# Altium project Elkapod_power_supply_controller_module.PrjPcb (part 3 of 5)

## Sheet Servos_controller.SchDoc
size A4; SheetNumber: 2; SheetTotal: 6
Used 3 times, as channels U_Servos_controller, U_Servos_controller, U_Servos_controller. Parts and nets are listed once, with the designators drawn on the sheet.
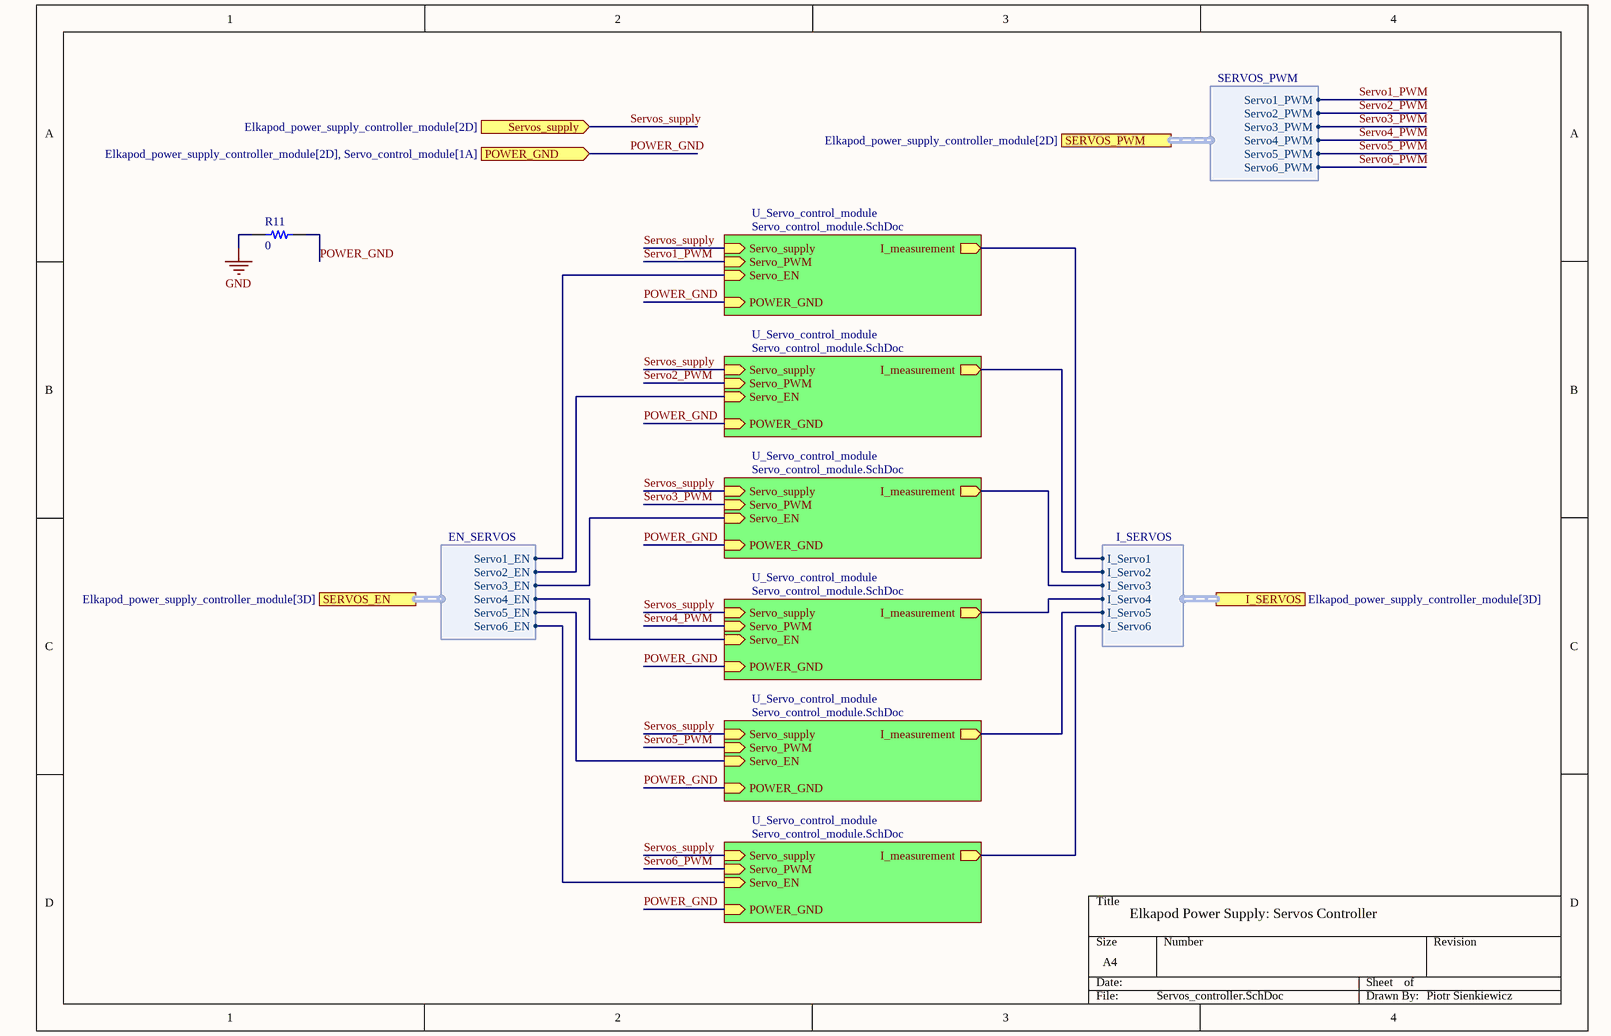
[diagram p6: Servos_controller.SchDoc]

### Parts
R11  0  [RES 0603_1608]

### Sub-sheets
U_Servo_control_module = Servo_control_module.SchDoc: Servo_supply (in), Servo_PWM (in), I_measurement (out), Servo_EN (in), POWER_GND (in)
U_Servo_control_module = Servo_control_module.SchDoc: Servo_supply (in), Servo_PWM (in), I_measurement (out), Servo_EN (in), POWER_GND (in)
U_Servo_control_module = Servo_control_module.SchDoc: Servo_supply (in), Servo_PWM (in), I_measurement (out), Servo_EN (in), POWER_GND (in)
U_Servo_control_module = Servo_control_module.SchDoc: Servo_supply (in), Servo_PWM (in), I_measurement (out), Servo_EN (in), POWER_GND (in)
U_Servo_control_module = Servo_control_module.SchDoc: Servo_supply (in), Servo_PWM (in), I_measurement (out), Servo_EN (in), POWER_GND (in)
U_Servo_control_module = Servo_control_module.SchDoc: Servo_supply (in), Servo_PWM (in), I_measurement (out), Servo_EN (in), POWER_GND (in)

### Ports
I_SERVOS (harness I_SERVOS, see Elkapod_power_supply_controller_module[3D]), POWER_GND (in, see Elkapod_power_supply_controller_module[2D], Servo_control_module[1A]), SERVOS_EN (harness EN_SERVOS, see Elkapod_power_supply_controller_module[3D]), SERVOS_PWM (harness SERVOS_PWM, see Elkapod_power_supply_controller_module[2D]), Servos_supply (in, see Elkapod_power_supply_controller_module[2D])

### Harnesses
I_SERVOS: I_Servo1, I_Servo2, I_Servo3, I_Servo4, I_Servo5, I_Servo6
EN_SERVOS: Servo1_EN, Servo2_EN, Servo3_EN, Servo4_EN, Servo5_EN, Servo6_EN
SERVOS_PWM: Servo1_PWM, Servo2_PWM, Servo3_PWM, Servo4_PWM, Servo5_PWM, Servo6_PWM

### Nets
GND: R11.1
POWER_GND: R11.2 ; port POWER_GND, sheet U_Servo_control_module/POWER_GND, sheet U_Servo_control_module/POWER_GND, sheet U_Servo_control_module/POWER_GND, sheet U_Servo_control_module/POWER_GND, sheet U_Servo_control_module/POWER_GND, sheet U_Servo_control_module/POWER_GND
Servo1_PWM: sheet U_Servo_control_module/Servo_PWM, port SERVOS_PWM.Servo1_PWM
Servo2_PWM: sheet U_Servo_control_module/Servo_PWM, port SERVOS_PWM.Servo2_PWM
Servo3_PWM: sheet U_Servo_control_module/Servo_PWM, port SERVOS_PWM.Servo3_PWM
Servo4_PWM: sheet U_Servo_control_module/Servo_PWM, port SERVOS_PWM.Servo4_PWM
Servo5_PWM: sheet U_Servo_control_module/Servo_PWM, port SERVOS_PWM.Servo5_PWM
Servo6_PWM: sheet U_Servo_control_module/Servo_PWM, port SERVOS_PWM.Servo6_PWM
Servos_supply: port Servos_supply, sheet U_Servo_control_module/Servo_supply, sheet U_Servo_control_module/Servo_supply, sheet U_Servo_control_module/Servo_supply, sheet U_Servo_control_module/Servo_supply, sheet U_Servo_control_module/Servo_supply, sheet U_Servo_control_module/Servo_supply
(unnamed): sheet U_Servo_control_module/I_measurement, port I_SERVOS.I_Servo1
(unnamed): sheet U_Servo_control_module/Servo_EN, port SERVOS_EN.Servo1_EN
(unnamed): sheet U_Servo_control_module/I_measurement, port I_SERVOS.I_Servo2
(unnamed): sheet U_Servo_control_module/Servo_EN, port SERVOS_EN.Servo2_EN
(unnamed): sheet U_Servo_control_module/I_measurement, port I_SERVOS.I_Servo3
(unnamed): sheet U_Servo_control_module/Servo_EN, port SERVOS_EN.Servo3_EN
(unnamed): sheet U_Servo_control_module/I_measurement, port I_SERVOS.I_Servo4
(unnamed): sheet U_Servo_control_module/Servo_EN, port SERVOS_EN.Servo4_EN
(unnamed): sheet U_Servo_control_module/I_measurement, port I_SERVOS.I_Servo5
(unnamed): sheet U_Servo_control_module/Servo_EN, port SERVOS_EN.Servo5_EN
(unnamed): sheet U_Servo_control_module/I_measurement, port I_SERVOS.I_Servo6
(unnamed): sheet U_Servo_control_module/Servo_EN, port SERVOS_EN.Servo6_EN

### Channels
U_Servos_controller: designators end in _U_Servos_controller#1; ports POWER_GND=POWER_GND Servos_supply=Servo_supply
U_Servos_controller: designators end in _U_Servos_controller#2; ports POWER_GND=POWER_GND Servos_supply=Servo_supply
U_Servos_controller: designators end in _U_Servos_controller#3; ports POWER_GND=POWER_GND Servos_supply=Servo_supply

### Notes on the sheet
- Elkapod Power Supply: Servos Controller
- Piotr Sienkiewicz

### Library data of the parts
R11 = RNCS0603BKE10K0: RES 0 OHM 1% 0,1W 0603; Manufacturer: Stackpole Electronics Inc; Power (Watts): 0.063W, 1/16W; Temperature Coefficient: ±25ppm/°C; Tolerance: ±0.1%; Part Number: RNCS0603BKE10K0; Value: 0; Composition: Thin Film; Device Package: 0603 (1608 Metric); Features: Anti-Corrosive, Automotive AEC-Q200, Moisture Resistant; Height - Seated (Max): 0.022" (0.55mm); LastUpdated: 09.02.2024 20:43:37; Lifecycle Status: Active; Minimum Order: 1; Number of Terminations: 2; Operating Temperature: -55°C ~ 155°C; Package / Case: 0603 (1608 Metric); Packaging: TapeAndReel; PartId: 4838; Part Status: Active; Price: 0.06; Ratings: AEC-Q200; Resistance: 0; Series: RNCS; Size / Dimension: 0.061" L x 0.031" W (1.55mm x 0.80mm); Supplier Device Package: 0603

## Sheet Servo_control_module.SchDoc
size A4; SheetNumber: 3; SheetTotal: 6
Used 18 times, as channels U_Servos_controller/U_Servo_control_module, U_Servos_controller/U_Servo_control_module, U_Servos_controller/U_Servo_control_module, U_Servos_controller/U_Servo_control_module, U_Servos_controller/U_Servo_control_module, U_Servos_controller/U_Servo_control_module, U_Servos_controller/U_Servo_control_module, U_Servos_controller/U_Servo_control_module, U_Servos_controller/U_Servo_control_module, U_Servos_controller/U_Servo_control_module, U_Servos_controller/U_Servo_control_module, U_Servos_controller/U_Servo_control_module, U_Servos_controller/U_Servo_control_module, U_Servos_controller/U_Servo_control_module, U_Servos_controller/U_Servo_control_module, U_Servos_controller/U_Servo_control_module, U_Servos_controller/U_Servo_control_module, U_Servos_controller/U_Servo_control_module. Parts and nets are listed once, with the designators drawn on the sheet.
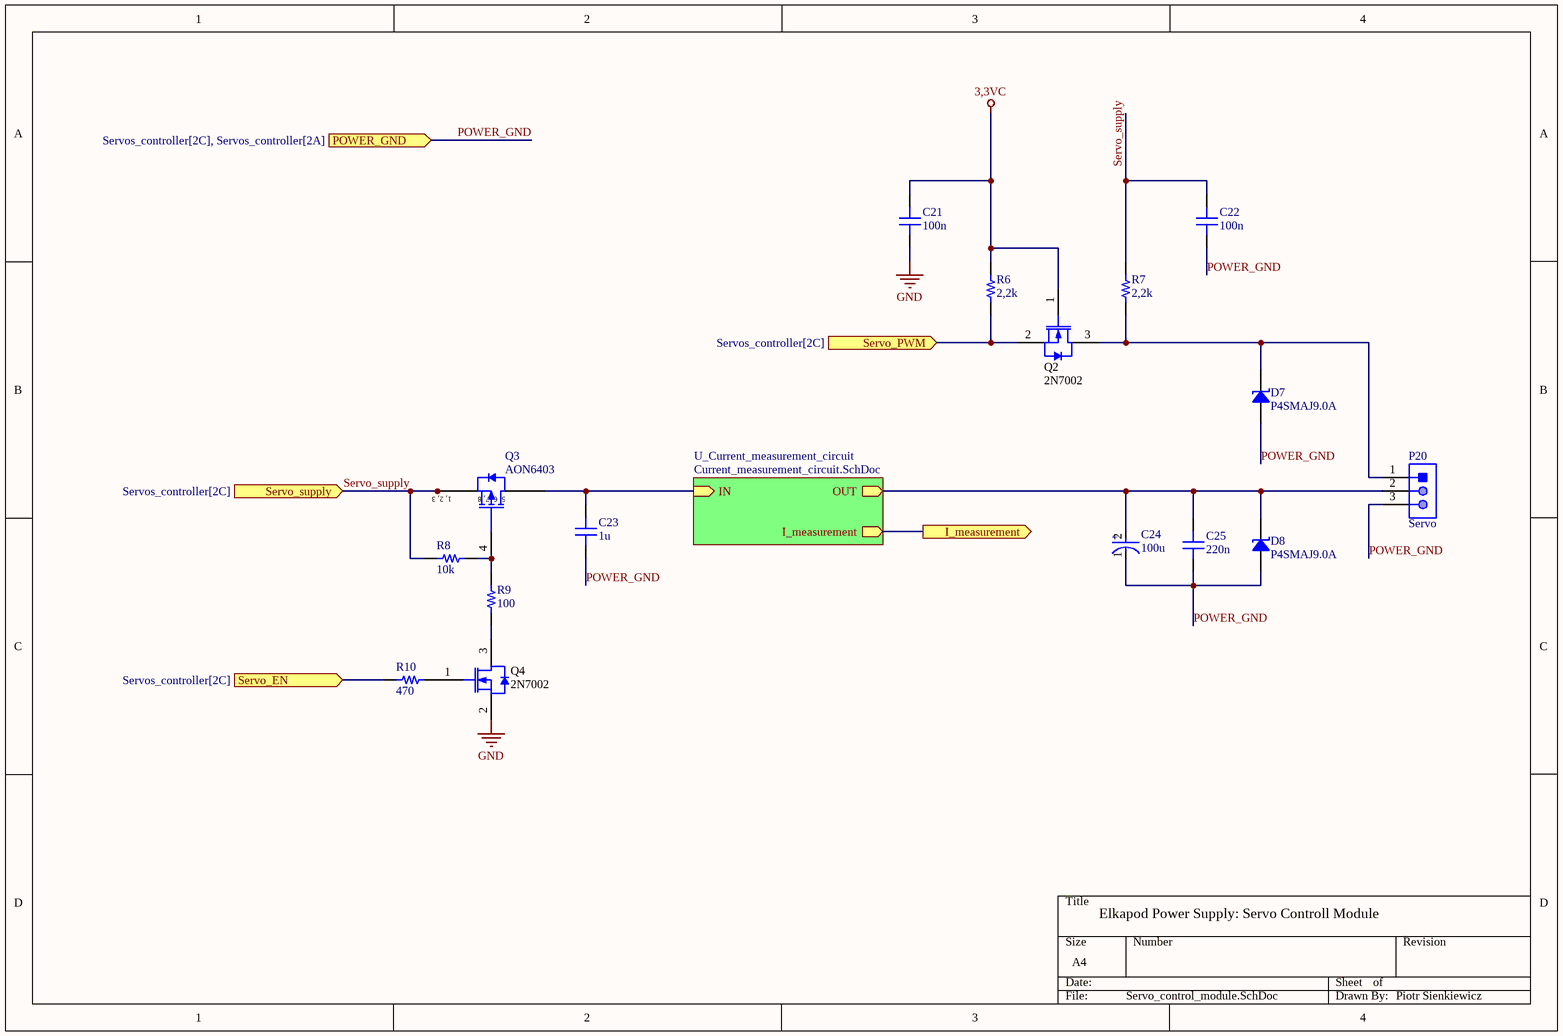
[diagram p7: Servo_control_module.SchDoc]

### Parts
C21  100n  [CAP 0603_1608]
C22  100n  [CAP 0603_1608]
C23  1u  [CAP 0603_1608]
C24  100u  [FP-FKE-MFG]
C25  220n  [CAP 0603_1608]
D7  P4SMAJ9.0A  [DO214AC SMA]
D8  P4SMAJ9.0A  [DO214AC SMA]
P20  Servo  [MOLX-22-23-2031_V]
Q2  2N7002  [INF-PG-SOT23_M]
Q3  AON6403  [DFN5x6]
Q4  2N7002  [INF-PG-SOT23_M]
R6  2,2k  [RES 0603_1608]
R7  2,2k  [RES 0603_1608]
R8  10k  [RES 0603_1608]
R9  100  [RES 0603_1608]
R10  470  [RES 0603_1608]

### Sub-sheets
U_Current_measurement_circuit = Current_measurement_circuit.SchDoc: I_measurement (out), IN (in), OUT (out)  | Rsense_value: 8m; C_value: 10u

### Ports
I_measurement (out, see Servos_controller[3C], Current_measurement_circuit[3B]), POWER_GND (in, see Servos_controller[2C], Servos_controller[2A]), Servo_EN (in, see Servos_controller[2C]), Servo_PWM (in, see Servos_controller[2C]), Servo_supply (in, see Servos_controller[2C])

### Nets
3,3VC: C21.2 Q2.1(GATE) R6.2
GND: C21.1 Q4.2(SOURCE)
I_measurement: port I_measurement, sheet U_Current_measurement_circuit/I_measurement
POWER_GND: C22.1 C23.1 C24.1(C) C25.2 D7.1 D8.1 P20.3 ; port POWER_GND
Servo_EN: R10.1 ; port Servo_EN
Servo_PWM: Q2.2(SOURCE) R6.1 ; port Servo_PWM
Servo_supply: C22.2 Q3.1(S) Q3.2(S) Q3.3(S) R7.2 R8.1 ; port Servo_supply
NetC23_2: C23.2 Q3.5(D) ; sheet U_Current_measurement_circuit/IN
NetC24_2: C24.2(A) C25.1 D8.2 P20.2 ; sheet U_Current_measurement_circuit/OUT
NetD7_2: D7.2 P20.1 Q2.3(DRAIN) R7.1
NetQ3_4: Q3.4(G) R8.2 R9.2
NetQ4_1: Q4.1(GATE) R10.2
NetQ4_3: Q4.3(DRAIN) R9.1

### Channels
U_Servos_controller/U_Servo_control_module: designators end in _U_Servos_controller_U_Servo_control_module#1; ports I_measurement=I_SERVO13 POWER_GND=POWER_GND Servo_EN=SERVO13_EN Servo_PWM=PWM13 Servo_supply=Servo_supply
U_Servos_controller/U_Servo_control_module: designators end in _U_Servos_controller_U_Servo_control_module#2; ports I_measurement=I_SERVO14 POWER_GND=POWER_GND Servo_EN=SERVO14_EN Servo_PWM=PWM14 Servo_supply=Servo_supply
U_Servos_controller/U_Servo_control_module: designators end in _U_Servos_controller_U_Servo_control_module#3; ports I_measurement=I_SERVO15 POWER_GND=POWER_GND Servo_EN=SERVO15_EN Servo_PWM=PWM15 Servo_supply=Servo_supply
U_Servos_controller/U_Servo_control_module: designators end in _U_Servos_controller_U_Servo_control_module#4; ports I_measurement=I_SERVO16 POWER_GND=POWER_GND Servo_EN=SERVO16_EN Servo_PWM=PWM16 Servo_supply=Servo_supply
U_Servos_controller/U_Servo_control_module: designators end in _U_Servos_controller_U_Servo_control_module#5; ports I_measurement=I_SERVO17 POWER_GND=POWER_GND Servo_EN=SERVO17_EN Servo_PWM=PWM17 Servo_supply=Servo_supply
U_Servos_controller/U_Servo_control_module: designators end in _U_Servos_controller_U_Servo_control_module#6; ports I_measurement=I_SERVO18 POWER_GND=POWER_GND Servo_EN=SERVO18_EN Servo_PWM=PWM18 Servo_supply=Servo_supply
U_Servos_controller/U_Servo_control_module: designators end in _U_Servos_controller_U_Servo_control_module#7; ports I_measurement=I_SERVO1 POWER_GND=POWER_GND Servo_EN=SERVO1_EN Servo_PWM=PWM1 Servo_supply=Servo_supply
U_Servos_controller/U_Servo_control_module: designators end in _U_Servos_controller_U_Servo_control_module#8; ports I_measurement=I_SERVO2 POWER_GND=POWER_GND Servo_EN=SERVO2_EN Servo_PWM=PWM2 Servo_supply=Servo_supply
U_Servos_controller/U_Servo_control_module: designators end in _U_Servos_controller_U_Servo_control_module#9; ports I_measurement=I_SERVO3 POWER_GND=POWER_GND Servo_EN=SERVO3_EN Servo_PWM=PWM3 Servo_supply=Servo_supply
U_Servos_controller/U_Servo_control_module: designators end in _U_Servos_controller_U_Servo_control_module#10; ports I_measurement=I_SERVO4 POWER_GND=POWER_GND Servo_EN=SERVO4_EN Servo_PWM=PWM4 Servo_supply=Servo_supply
U_Servos_controller/U_Servo_control_module: designators end in _U_Servos_controller_U_Servo_control_module#11; ports I_measurement=I_SERVO5 POWER_GND=POWER_GND Servo_EN=SERVO5_EN Servo_PWM=PWM5 Servo_supply=Servo_supply
U_Servos_controller/U_Servo_control_module: designators end in _U_Servos_controller_U_Servo_control_module#12; ports I_measurement=I_SERVO6 POWER_GND=POWER_GND Servo_EN=SERVO6_EN Servo_PWM=PWM6 Servo_supply=Servo_supply
U_Servos_controller/U_Servo_control_module: designators end in _U_Servos_controller_U_Servo_control_module#13; ports I_measurement=I_SERVO7 POWER_GND=POWER_GND Servo_EN=SERVO7_EN Servo_PWM=PWM7 Servo_supply=Servo_supply
U_Servos_controller/U_Servo_control_module: designators end in _U_Servos_controller_U_Servo_control_module#14; ports I_measurement=I_SERVO8 POWER_GND=POWER_GND Servo_EN=SERVO8_EN Servo_PWM=PWM8 Servo_supply=Servo_supply
U_Servos_controller/U_Servo_control_module: designators end in _U_Servos_controller_U_Servo_control_module#15; ports I_measurement=I_SERVO9 POWER_GND=POWER_GND Servo_EN=SERVO9_EN Servo_PWM=PWM9 Servo_supply=Servo_supply
U_Servos_controller/U_Servo_control_module: designators end in _U_Servos_controller_U_Servo_control_module#16; ports I_measurement=I_SERVO10 POWER_GND=POWER_GND Servo_EN=SERVO10_EN Servo_PWM=PWM10 Servo_supply=Servo_supply
U_Servos_controller/U_Servo_control_module: designators end in _U_Servos_controller_U_Servo_control_module#17; ports I_measurement=I_SERVO11 POWER_GND=POWER_GND Servo_EN=SERVO11_EN Servo_PWM=PWM11 Servo_supply=Servo_supply
U_Servos_controller/U_Servo_control_module: designators end in _U_Servos_controller_U_Servo_control_module#18; ports I_measurement=I_SERVO12 POWER_GND=POWER_GND Servo_EN=SERVO12_EN Servo_PWM=PWM12 Servo_supply=Servo_supply

### Notes on the sheet
- Elkapod Power Supply: Servo Controll Module
- Piotr Sienkiewicz
- (in symbol AON6403) 1, 2, 3; 5, 6, 7, 8
- (in symbol CMP-2000-06205-2) +

### Library data of the parts
C21 C22 = C0603C272F3GAC7867: CAP CER 100nF 25V X5R 0603; manufacturer: KEMET; Temperature Coefficient: C0G, NP0; Tolerance: ±1%; Part Number: C0603C272F3GAC7867; Value: 100n; Applications: General Purpose; Capacitance: 100n; componentlink1description: Datasheet; componentlink1url: https://api.kemet.com/component-edge/download/datasheet/C0603C272F3GACTU.pdf; componentlink2description: DigiKey Link; componentlink2url: https://www.digikey.com/en/products/detail/kemet/C0603C272F3GAC7867/2200413; Device Package: 0603 (1608 Metric); Features: Low ESL; lastupdated: 09.02.2024 20:10:30; Lifecycle Status: Active; Minimum Order: 1; Mounting Type: Surface Mount, MLCC; Operating Temperature: -55°C ~ 125°C; Package / Case: 0603 (1608 Metric); packaging: TapeAndReel; partid: 2138; Part Status: Active; price: 0.40; series: SMD Comm C0G; Size / Dimension: 0.063" L x 0.031" W (1.60mm x 0.80mm); Thickness (Max): 0.034" (0.87mm); Voltage - Rated: 25V
C23 = C0603C272F3GAC7867: CAP CER 1uF 16V X5R 0603; manufacturer: KEMET; Temperature Coefficient: C0G, NP0; Tolerance: ±1%; Voltage - Rated: 25V; Part Number: C0603C272F3GAC7867; Value: 1u; Applications: General Purpose; Capacitance: 1u; componentlink1description: Datasheet; componentlink1url: https://api.kemet.com/component-edge/download/datasheet/C0603C272F3GACTU.pdf; componentlink2description: DigiKey Link; componentlink2url: https://www.digikey.com/en/products/detail/kemet/C0603C272F3GAC7867/2200413; Device Package: 0603 (1608 Metric); Features: Low ESL; lastupdated: 09.02.2024 20:10:30; Lifecycle Status: Active; Minimum Order: 1; Mounting Type: Surface Mount, MLCC; Operating Temperature: -55°C ~ 125°C; Package / Case: 0603 (1608 Metric); packaging: TapeAndReel; partid: 2138; Part Status: Active; price: 0.40; series: SMD Comm C0G; Size / Dimension: 0.063" L x 0.031" W (1.60mm x 0.80mm); Thickness (Max): 0.034" (0.87mm)
C24 = CMP-2000-06205-2: CAP ALUM 100UF 20% 25V SMD; Ripple Current (AC): 300mA; Leakage Current: 3uA; Dielectric Material: Aluminium; Impedance: 260mR; Life (Hours): 2000Hour; Max Operating Temperature: 105°C; Voltage Rating (DC): 25V; Packaging: Tape and Reel; Min Operating Temperature: -55°C; Capacitance: 100uF; Ripple Current: 300mA; Mount: Surface Mount; Lead Free: Lead Free; Construction: Cylindrical; Voltage Rating: 25V; RoHS Compliant: Yes; Case/Package: Radial; Height: 6.2mm; Tolerance: 20%; Diameter: 8mm; Termination: SMD/SMT; Package Quantity: 1; Width: 8.3mm; REACH SVHC: No SVHC; Series: FK; Number of Pins: 2; Voltage: 25V; Radiation Hardening: No; Height - Seated (Max): 0.244inch; Length: 6.2mm; ESR (Equivalent Series Resistance): 260mR
C25 = C0603C272F3GAC7867: CAP CER 220nF 25V X5R 0603; manufacturer: KEMET; Temperature Coefficient: C0G, NP0; Tolerance: ±1%; Part Number: C0603C272F3GAC7867; Value: 220n; Applications: General Purpose; Capacitance: 220n; componentlink1description: Datasheet; componentlink1url: https://api.kemet.com/component-edge/download/datasheet/C0603C272F3GACTU.pdf; componentlink2description: DigiKey Link; componentlink2url: https://www.digikey.com/en/products/detail/kemet/C0603C272F3GAC7867/2200413; Device Package: 0603 (1608 Metric); Features: Low ESL; lastupdated: 09.02.2024 20:10:30; Lifecycle Status: Active; Minimum Order: 1; Mounting Type: Surface Mount, MLCC; Operating Temperature: -55°C ~ 125°C; Package / Case: 0603 (1608 Metric); packaging: TapeAndReel; partid: 2138; Part Status: Active; price: 0.40; series: SMD Comm C0G; Size / Dimension: 0.063" L x 0.031" W (1.60mm x 0.80mm); Thickness (Max): 0.034" (0.87mm); Voltage - Rated: 25V
D7 D8 = SMA6J18A-TP: TVS DIODE 9VDC DO214AC; Part Number: P4SMAJ9.0A
P20 = CMP-2000-05242-1: Male Header, Pitch 2.54 mm, 1 x 3 Position, Height 8.18 mm, Tail Length 3.56 mm, RoHS, Bulk; Current Rating: 4A; Brand: Molex; Pitch: 2.54mm; Voltage Rating: 250V; Mounting Angle: Vertical; Type: Locking; Factory Pack Quantity: 16000; Tradename: KK; Housing Material: Nylon; Contact Material: Brass; Manufacturer URL: http://www.molex.com/; Termination Style: ThroughHole; Mounting Style: ThroughHole; Number of Positions: 3Position; Contact Gender: Pin(Male); Packaging: Bulk; Series: 6373; Datasheet Version: Sep-01; Contact Plating: Tin; Product: Headers; Datasheet URL: https://datasheet.ciiva.com/19472/232274-19472863.pdf; RoHS: Details; Product Category: Headers&WireHousings; Manufacturer: Molex; Number of Rows: 1Row
Q2 Q4 = CMP-1149-00026-1: N-Channel OptiMOS Small-Signal-Transistor, 60 V VDS, 0.3 A ID, -55 to 150 degC, PG-SOT23, Reel, Green; Manufacturer: Infineon; RDS (on) (max) (@4.5V): 4,000 mOhm; VDS (max): 60 V; IDpuls (max): 1.2Â A; QG: 0.4Â nC; RDS (on) (max): 3,000 mOhm; RthJA (max): 250 K/W; ID (max): 0.3Â A; VGS(th) (max): 2.5Â V; VGS(th) (min): 1.5Â V; Green: TRUE; Ptot (max): 0.5Â W; PackageDescription: 3-Pin Small Outline Transistor Package, 2.9 x 1.3 mm Body, 0.95 mm Pitch; Halogen-free: TRUE; ComponentLink2Description: Datasheet; ComponentLink1URL: http://www.infineon.com/; Packing: Reel; DatasheetVersion: Rev. 2.4; PartNumber: 2N7002; PackageReference: PG-SOT23; PackageVersion: Apr-08; ComponentLink3URL: http://www.infineon.com/dgdl/SOT23-Package_Overview.pdf?folderId=db3a30431936bc4b0119532290053c66&fileId=db3a30431936bc4b0119533468123c85; ComponentLink1Description: Manufacturer URL; Mounting Technology: Surface Mount; ComponentLink3Description: Package Specification; ComponentLink2URL: http://www.infineon.com/dgdl/2N7002_Rev2.4.pdf?folderId=db3a3043156fd573011622e10b5c1f67&fileId=db3a304319bc939a0119c2a9461e79e6
Q3 = AON6403: P-MOSFET; 67A; 30V; DFN5x6
R6 R7 = RNCS0603BKE10K0: RES 2,2K OHM 1% 0,1W 0603; Manufacturer: Stackpole Electronics Inc; Power (Watts): 0.063W, 1/16W; Temperature Coefficient: ±25ppm/°C; Tolerance: ±0.1%; Part Number: RNCS0603BKE10K0; Value: 2,2k; Composition: Thin Film; Device Package: 0603 (1608 Metric); Features: Anti-Corrosive, Automotive AEC-Q200, Moisture Resistant; Height - Seated (Max): 0.022" (0.55mm); LastUpdated: 09.02.2024 20:43:37; Lifecycle Status: Active; Minimum Order: 1; Number of Terminations: 2; Operating Temperature: -55°C ~ 155°C; Package / Case: 0603 (1608 Metric); Packaging: TapeAndReel; PartId: 4838; Part Status: Active; Price: 0.06; Ratings: AEC-Q200; Resistance: 2,2k; Series: RNCS; Size / Dimension: 0.061" L x 0.031" W (1.55mm x 0.80mm); Supplier Device Package: 0603
R8 = RNCS0603BKE10K0: RES 10K OHM 1% 0,1W 0603; Manufacturer: Stackpole Electronics Inc; Power (Watts): 0.063W, 1/16W; Temperature Coefficient: ±25ppm/°C; Tolerance: ±0.1%; Part Number: RNCS0603BKE10K0; Value: 10k; Composition: Thin Film; Device Package: 0603 (1608 Metric); Features: Anti-Corrosive, Automotive AEC-Q200, Moisture Resistant; Height - Seated (Max): 0.022" (0.55mm); LastUpdated: 09.02.2024 20:43:37; Lifecycle Status: Active; Minimum Order: 1; Number of Terminations: 2; Operating Temperature: -55°C ~ 155°C; Package / Case: 0603 (1608 Metric); Packaging: TapeAndReel; PartId: 4838; Part Status: Active; Price: 0.06; Ratings: AEC-Q200; Resistance: 10k; Series: RNCS; Size / Dimension: 0.061" L x 0.031" W (1.55mm x 0.80mm); Supplier Device Package: 0603
R9 = RNCS0603BKE10K0: RES 100 OHM 1% 0,1W 0603; Manufacturer: Stackpole Electronics Inc; Power (Watts): 0.063W, 1/16W; Temperature Coefficient: ±25ppm/°C; Tolerance: ±0.1%; Part Number: RNCS0603BKE10K0; Value: 100; Composition: Thin Film; Device Package: 0603 (1608 Metric); Features: Anti-Corrosive, Automotive AEC-Q200, Moisture Resistant; Height - Seated (Max): 0.022" (0.55mm); LastUpdated: 09.02.2024 20:43:37; Lifecycle Status: Active; Minimum Order: 1; Number of Terminations: 2; Operating Temperature: -55°C ~ 155°C; Package / Case: 0603 (1608 Metric); Packaging: TapeAndReel; PartId: 4838; Part Status: Active; Price: 0.06; Ratings: AEC-Q200; Resistance: 100; Series: RNCS; Size / Dimension: 0.061" L x 0.031" W (1.55mm x 0.80mm); Supplier Device Package: 0603
R10 = RNCS0603BKE10K0: RES 470 OHM 1% 0,1W 0603; Manufacturer: Stackpole Electronics Inc; Power (Watts): 0.063W, 1/16W; Temperature Coefficient: ±25ppm/°C; Tolerance: ±0.1%; Part Number: RNCS0603BKE10K0; Value: 470; Composition: Thin Film; Device Package: 0603 (1608 Metric); Features: Anti-Corrosive, Automotive AEC-Q200, Moisture Resistant; Height - Seated (Max): 0.022" (0.55mm); LastUpdated: 09.02.2024 20:43:37; Lifecycle Status: Active; Minimum Order: 1; Number of Terminations: 2; Operating Temperature: -55°C ~ 155°C; Package / Case: 0603 (1608 Metric); Packaging: TapeAndReel; PartId: 4838; Part Status: Active; Price: 0.06; Ratings: AEC-Q200; Resistance: 470; Series: RNCS; Size / Dimension: 0.061" L x 0.031" W (1.55mm x 0.80mm); Supplier Device Package: 0603